# EasyEDA Pro project motherboard.epro

# Schematic Schematic1
Board Name: Board1; Create Date: 2025-01-26; Page Name: P1; Project Name: boxie-board; Schematic Name: Schematic1; Update Date: 2025-01-29; Company: EasyEDA.com; Drawn: EasyEDA; Page Size: A4; Part Number: JLCPCB-002; Reviewed: EasyEDA; Version: V0.1
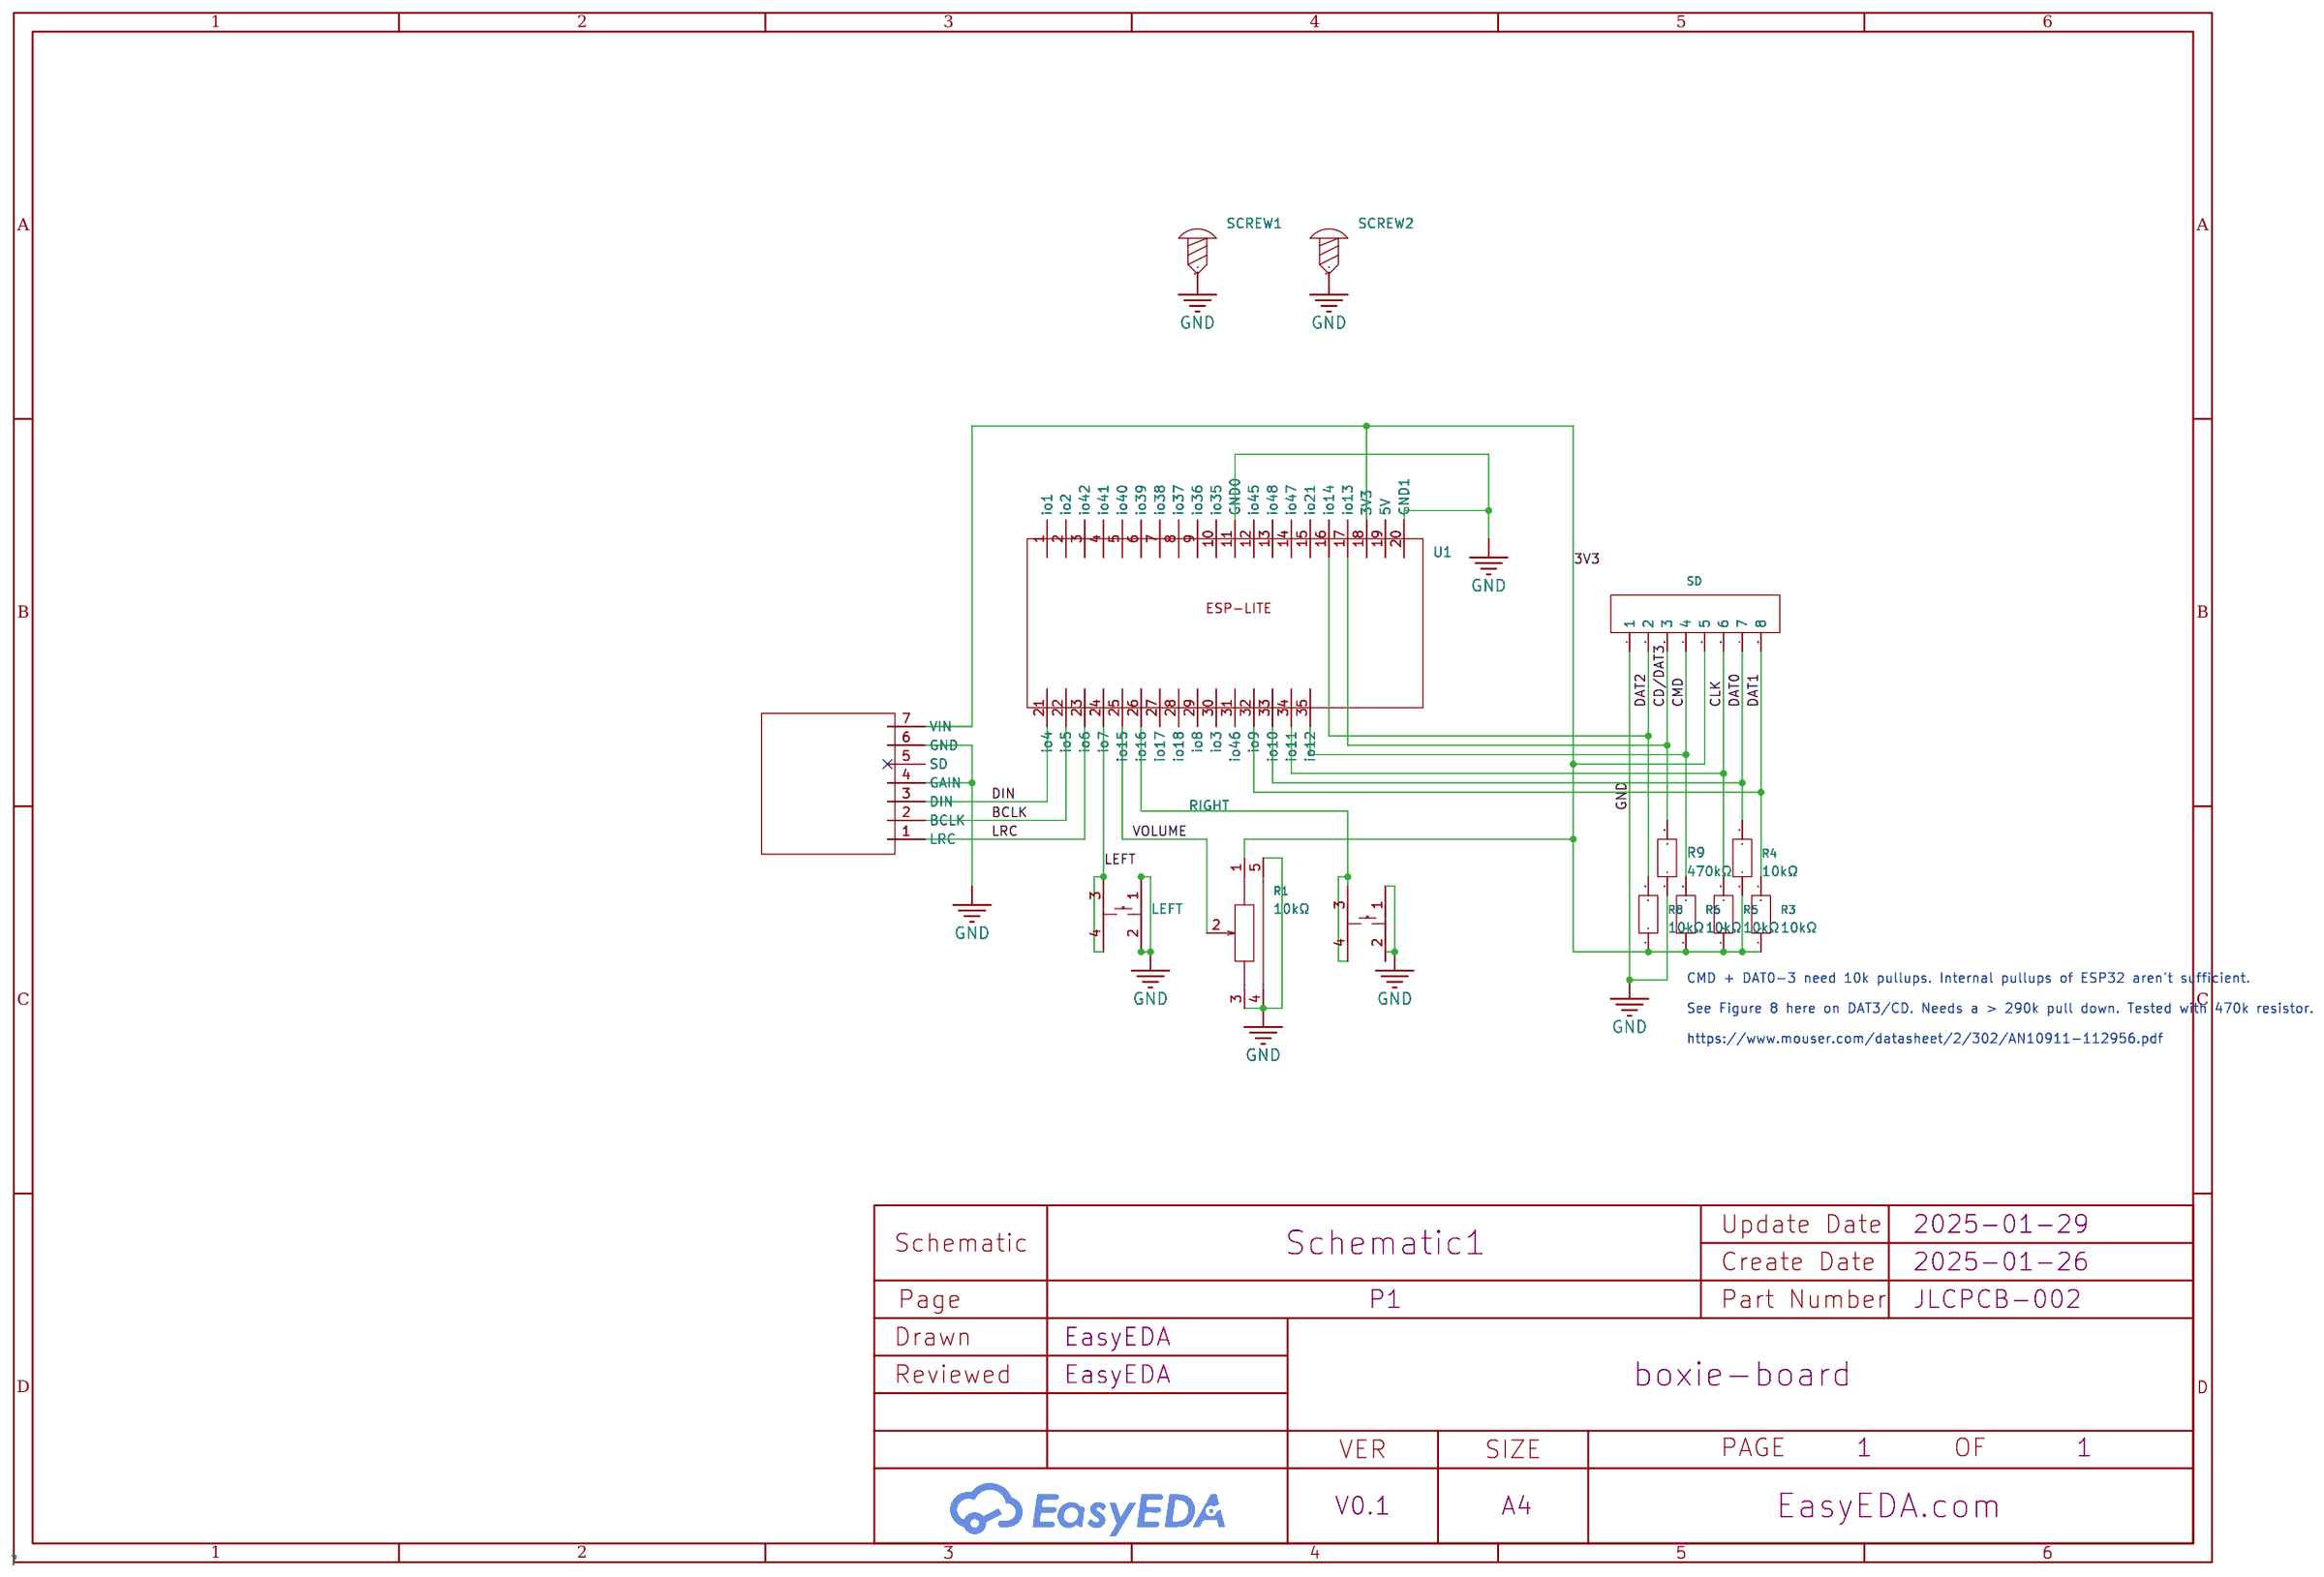
[diagram p0: schematic sheet]

## Parts
LEFT  GT-TC074E-H045-L1  [SW-SMD_4P-L4.5-W4.5-P3.00-LS7.5]
R1  10kΩ  [RES-TH_RK09K1130AAU]
R3  10kΩ  [R0805]
R4  10kΩ  [R0805]
R5  10kΩ  [R0805]
R6  10kΩ  [R0805]
R8  10kΩ  [R0805]
R9  470kΩ  [R0805]
RIGHT  GT-TC074E-H045-L1  [SW-SMD_4P-L4.5-W4.5-P3.00-LS7.5]
SCREW1  -  [Screw-Hole-M3]
SCREW2  -  [Screw-Hole-M3]
SD  -  [HDR-TH_8P-P2.54-V-F-1]
U1  -  [esp32-lite]
U4  MAX98357A-I2S  [MAX98357A_I2S_footprint]

## Library data of the parts
LEFT RIGHT = GT-TC074E-H045-L1: Circuit:SPST Actuator Style:Round Button Operating Force:130gf Mounting Style:Brick nogging Switch Length:4.5mm Switch Width:4.5mm Switch Height:4.5mm Strike Gundam:不带 Contact Current:50mA Voltage Rating (DC):12V Insulation Resistance:100MΩ Actuator/Cap C; LCSC Part Name: 4.5*4.5*4.5mm 立贴 轻触开关; Supplier Part: C963226; Manufacturer: G-Switch(品赞); Supplier Footprint: SMD; JLCPCB Part Class: Extended Part; Datasheet: https://atta.szlcsc.com/upload/public/pdf/source/20200902/C778171_CAA5F7D188867E23168B3FF42AF8C49B.pdf; Supplier: LCSC; Circuit: SPST; Actuator Style: Round Button; Operating Force: 130gf; Mounting Style: Brick nogging; Switch Length: 4.5mm; Switch Width: 4.5mm; Switch Height: 4.5mm; Strike Gundam: 不带; Contact Current: 50mA; Voltage Rating (DC): 12V; Insulation Resistance: 100MΩ; Actuator/Cap Color: Black; With Lamp: No; Pin Style: Gull Wing; Mechanical Life: 10万次; Operating Temperature: -30℃~+85℃
R1 = RK09K1130AAU: Resistance: Tolerance:±20% Tolerance:±20%; LCSC Part Name: 10kΩ ±20%; Supplier Part: C202373; Manufacturer: ALPSALPINE(阿尔卑斯阿尔派); Supplier Footprint: 插件; JLCPCB Part Class: Extended Part; Datasheet: https://atta.szlcsc.com/upload/public/pdf/source/20180403/C202373_6A10D7C408ADBD3CAC5DCE7BA8BA3007.pdf; Supplier: LCSC; Tolerance: ±20%
R3-R6 R8 = ERA6VEB1002V: Type:Thin Film Resistor Resistance:10kΩ Tolerance:±0.1% Tolerance:±0.1% Power(Watts): Overload Voltage (Max): Temperature Coefficient:±25ppm/℃ Temperature Coefficient:±25ppm/℃ Operating Temperature Range:-55℃~+155℃ Operating Temperature Range:-55℃~+155℃; LCSC Part Name: 10kΩ ±0.1% 250mW 薄膜电阻; Supplier Part: C490804; Manufacturer: PANASONIC(松下); Supplier Footprint: 0805; JLCPCB Part Class: Extended Part; Datasheet: https://atta.szlcsc.com/upload/public/pdf/source/20200407/C490804_E79445038A464C1C5FF8B3F1C2F9F4D4.pdf; Supplier: LCSC; Type: Thin Film Resistor; Tolerance: ±0.1%; Temperature Coefficient: ±25ppm/℃; Operating Temperature Range: -55℃~+155℃
R9 = ERJ6GEYJ474V: Type:Thick Film Resistors Resistance:470kΩ Tolerance:±5% Tolerance:±5% Power(Watts): Overload Voltage (Max):- Temperature Coefficient:±200ppm/℃ Temperature Coefficient:±200ppm/℃ Operating Temperature Range:-55℃~+155℃ Operating Temperature Range:-55℃~+155℃; LCSC Part Name: 470kΩ ±5% 125mW 厚膜电阻; Supplier Part: C413225; Manufacturer: PANASONIC(松下); Supplier Footprint: 0805; JLCPCB Part Class: Extended Part; Datasheet: https://atta.szlcsc.com/upload/public/pdf/source/20190820/C413225_BF0E9D17BD6FA7B1F7DA2197481910D1.pdf; Supplier: LCSC; Type: Thick Film Resistors; Tolerance: ±5%; Temperature Coefficient: ±200ppm/℃; Operating Temperature Range: -55℃~+155℃
SCREW1 SCREW2 = Screw-Hole-M3: Supplier Footprint: 插件
SD = HDR-F_2.54_1x8P: Supplier: LCSC; Manufacturer: BOOMELE(博穆精密); Manufacturer Part: 2.54-1*8P母环保; Supplier Part: C27438; JLCPCB Part Class: Extended Part; Supplier Footprint: Through
U1 = esp32-lite
U4 = MAX98357 Breakboard

## Nets
3V3: R1.1 R3.1 R4.2 R5.1 R6.1 R8.1 SD.5 U1.18(3V3) U4.7(VIN)
GND: LEFT.1 LEFT.2 R1.3 R1.4(EH) R1.5(EH) R9.1 RIGHT.1 RIGHT.2 SCREW1.1 SCREW2.1 SD.1 U1.11(GND0) U1.20(GND1) U4.4(GAIN) U4.6(GND)
BCLK: U1.22(io5) U4.2(BCLK)
CD/DAT3: R9.2 SD.3 U1.17(io13)
CLK: R5.2 SD.6 U1.34(io11)
CMD: R6.2 SD.4 U1.35(io12)
DAT0: R4.1 SD.7 U1.33(io10)
DAT1: R3.2 SD.8 U1.32(io9)
DAT2: R8.2 SD.2 U1.16(io14)
DIN: U1.21(io4) U4.3(DIN)
LEFT: LEFT.3 LEFT.4 U1.24(io7)
LRC: U1.23(io6) U4.1(LRC)
VOLUME: R1.2 U1.25(io15)
$1N966: RIGHT.3 RIGHT.4 U1.26(io16)

Not connected (* = marked no-connect by the designer): U1 1(io1) 2(io2) 3(io42) 4(io41) 5(io40) 6(io39) 7(io38) 8(io37) 9(io36) 10(io35) 12(io45) 13(io48) 14(io47) 15(io21) 19(5V) 27(io17) 28(io18) 29(io8) 30(io3) 31(io46); U4 5(SD)*

## Notes on the sheet
- CMD + DAT0-3 need 10k pullups. Internal pullups of ESP32 aren't sufficient.
  See Figure 8 here on DAT3/CD. Needs a > 290k pull down. Tested with 470k resistor.
  https://www.mouser.com/datasheet/2/302/AN10911-112956.pdf

# Board PCB1
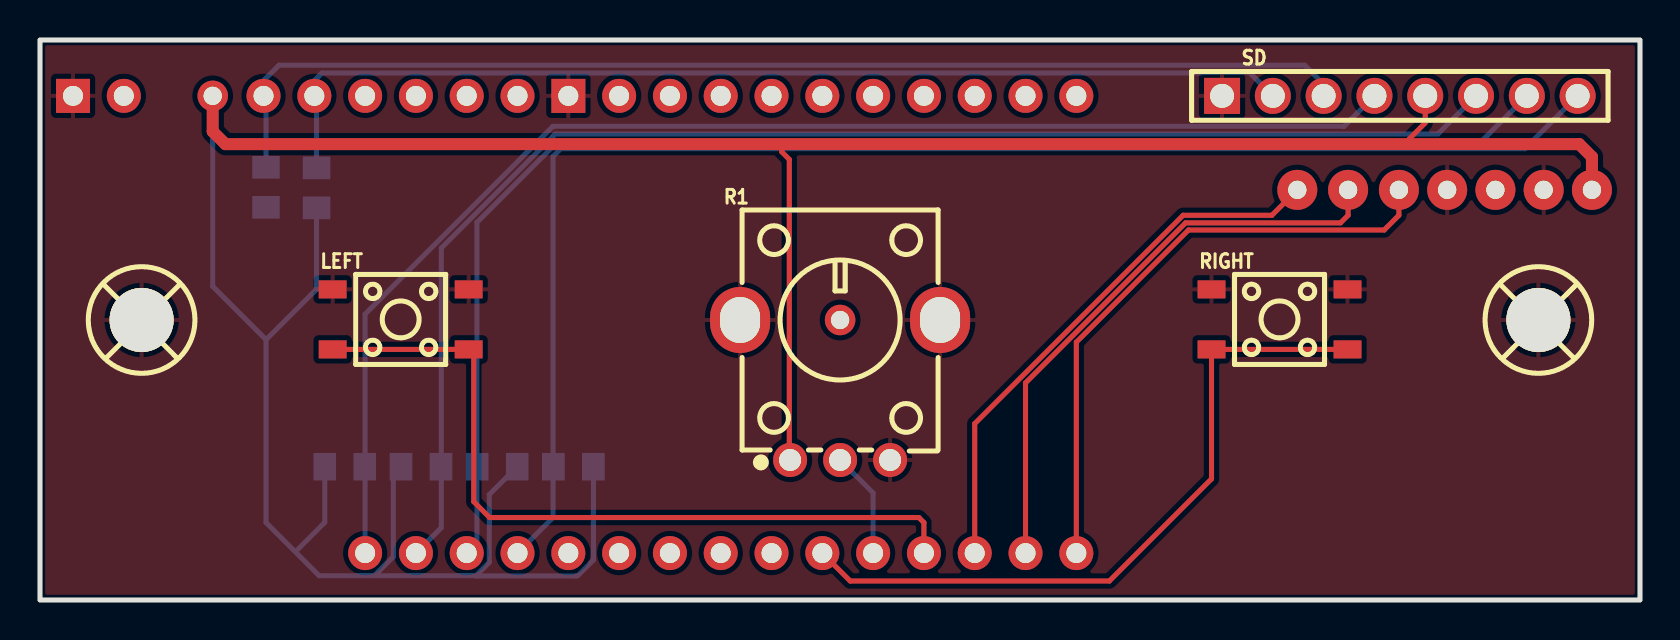
[diagram p1: board, top side]
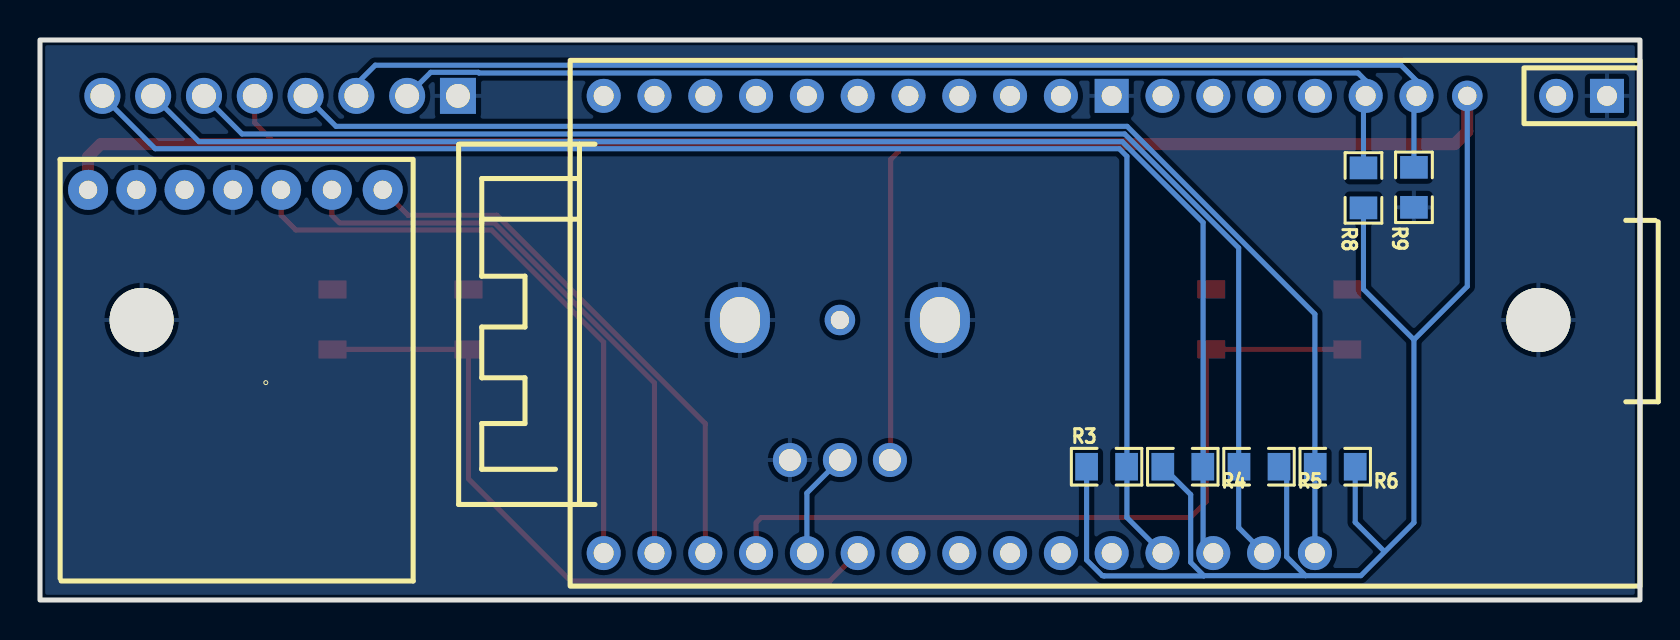
[diagram p2: board, bottom side, seen from below]

Outline 80 x 28 mm; copper layers: Top Layer, Bottom Layer. Coordinates in mm from the lower left corner of the outline.
Outline path: rectangle 0,28 80,0
Stack: Top Layer 0.035mm / Dielectric1 1.51mm FR4 er 4.5 / Bottom Layer 0.035mm

## Design rules (mm)
template: JLCPCB Capability(Two Layers Board)
spacing copperThickness1oz (default): track to track 0.102, other pairs 0.152 to 0.3
spacing copperThickness2oz: track to track 0.203, other pairs 0.152 to 0.3
track width copperThickness1oz (default): min 0.127, default 0.254, max 2.54
track width copperThickness2oz: min 0.203, default 0.254, max 2.54
differential pair differentialPair (default): width min 0.127, default 0.254, max 2.54; gap min 0.152, default 0.152
via viaSize (default): diameter min 0.5, default 0.61, max 10; hole min 0.3, default 0.305, max 6.3

## Placement (name value [footprint] x y rotation side)
LEFT  GT-TC074E-H045-L1  [SW-SMD_4P-L4.5-W4.5-P3.00-LS7.5]  18.03 14.03 0 top
NOREF  -  [Pad_e17]  40 14 0 top
R1  10kΩ  [RES-TH_RK09K1130AAU]  40 10.5 0 top
R3  10kΩ  [R0805]  26.67 6.66 180 bottom
R4  10kΩ  [R0805]  22.86 6.66 0 bottom
R5  10kΩ  [R0805]  19.05 6.66 0 bottom
R6  10kΩ  [R0805]  15.24 6.66 0 bottom
R8  10kΩ  [R0805]  13.83 20.6 90 bottom
R9  470kΩ  [R0805]  11.3 20.63 90 bottom
RIGHT  GT-TC074E-H045-L1  [SW-SMD_4P-L4.5-W4.5-P3.00-LS7.5]  61.98 14.03 0 top
SCREW1  -  [Screw-Hole-M3]  5.14 13.94 0 top
SCREW2  -  [Screw-Hole-M3]  74.98 13.94 0 top
SD  -  [HDR-TH_8P-P2.54-V-F-1]  67.99 25.21 0 top
U1  -  [esp32-lite]  0.25 0.31 0 bottom
U4  MAX98357A-I2S  [MAX98357A_I2S_footprint]  70.74 12.63 0 bottom

## Footprints (pads in the part's own frame, mm; a bottom-side part is the same pattern mirrored in y, then rotated)
esp32-lite
  round 1.7 hole 1: 1(51.562,-24.892) 2(49.022,-24.892) 3(46.482,-24.892) 4(43.942,-24.892) 5(41.402,-24.892) 6(38.862,-24.892) 7(36.322,-24.892) 8(33.782,-24.892) 9(31.242,-24.892) 10(28.702,-24.892) 12(23.622,-24.892) 13(21.082,-24.892) 14(18.542,-24.892) 15(16.002,-24.892) 16(13.462,-24.892) 17(10.922,-24.892) 19(3.937,-24.892) 21(51.562,-2.032) 22(49.022,-2.032) 23(46.482,-2.032) 24(43.942,-2.032) 25(41.402,-2.032) 26(38.862,-2.032) 27(36.322,-2.032) 28(33.782,-2.032) 29(31.242,-2.032) 30(28.702,-2.032) 31(26.162,-2.032) 32(23.622,-2.032) 33(21.082,-2.032) 34(18.542,-2.032) 35(16.002,-2.032)
  rect 1.7x1.7 hole 1: 11(26.162,-24.892) 20(1.397,-24.892)
  round 1.524 hole 0.914: 18(8.382,-24.892)
HDR-TH_8P-P2.54-V-F-1
  rect 1.8x1.8 hole 1.2: 1(-8.89,0)
  round 1.8 hole 1.2: 2(-6.35,0) 3(-3.81,0) 4(-1.27,0) 5(1.27,0) 6(3.81,0) 7(6.35,0) 8(8.89,0)
MAX98357A_I2S_footprint
  round 2 hole 0.914: 1(-7.874,-7.874) 2(-5.334,-7.874) 3(-2.794,-7.874) 4(-0.381,-7.874) 5(2.032,-7.874) 6(4.445,-7.874) 7(6.858,-7.874)
Pad_e17
  round 1.524 hole 0.914: 1(0,0)
R0805
  rect 1.133x1.377 smd: 1(-1,0) 2(1,0)
RES-TH_RK09K1130AAU
  round 1.7 hole 1.1: 1(-2.5,-3.5) 2(0,-3.5) 3(2.5,-3.5)
  oval 3x3.3 hole 2x2.3: 4(5,3.5) 5(-5,3.5)
Screw-Hole-M3
  round 3.2 hole 3.2: 1(-0.064,0.064)
SW-SMD_4P-L4.5-W4.5-P3.00-LS7.5
  rect 1.4x0.9 smd: 1(-3.4,1.5) 2(3.4,1.5) 3(-3.4,-1.5) 4(3.4,-1.5)

## Nets
As in the schematic.

Pads without a net: NOREF 1; U1 1 2 3 4 5 6 7 8 9 10 12 13 14 15 19 27 28 29 30 31; U4 5

## Routing (per net, layer and track width the routed paths; a pad name or vN(x,y) marks a point on that pad's centre or on a via; arc(x,y) is an arc through that point)
3V3: length 160.7
  Top Layer w0.254: 37.08,22.54 37.08,22.41 37.47,22.03 37.47,7.04 R1.1 ; 68.45,23.05 69.26,23.86 SD.5
  Top Layer w0.6: 77.6,20.51 77.6,22.16 76.96,22.79 9.27,22.79 8.64,23.43 U1.18
  Bottom Layer w0.254: 21.8,1.22 16.72,1.22 ; 21.8,1.22 22.47,1.88 22.47,5.27 R4.2 ; 21.8,1.22 21.82,1.2 26.8,1.2 26.81,1.22 26.88,1.22 27.67,2 R3.1 ; 16.72,1.22 17.67,2.16 17.67,6.28 R5.1 ; 16.72,1.22 13.96,1.22 11.3,3.87 11.3,13.01 ; R6.1 14.24,3.89 12.83,2.47 ; 11.3,13.01 13.83,15.54 R8.1 ; 11.3,13.01 8.64,15.68 U1.18
BCLK: length 29.4
  Top Layer w0.254: 65.41,20.51 65.41,19.24 65.02,18.86 57.28,18.86 49.28,10.86 U1.22
CD/DAT3: length 58.7
  Bottom Layer w0.254: SD.3 64.18,25.79 63.24,26.74 11.95,26.74 11.18,25.97 U1.17 11.3,25.08 R9.2
CLK: length 70.7
  Bottom Layer w0.254: SD.6 69.9,23.3 25.76,23.3 20.07,17.6 20.07,3.62 U1.34
CMD: length 66.9
  Bottom Layer w0.254: U1.35 16.26,14.3 25.64,23.68 65.2,23.68 SD.4
DAT0: length 71.9
  Bottom Layer w0.254: SD.7 72.06,22.92 25.89,22.92 21.84,18.88 21.84,2.85 U1.33
DAT1: length 73.1
  Bottom Layer w0.254: U1.32 25.65,4.12 25.65,22.18 26.03,22.56 74.24,22.56 SD.8
DAT2: length 53
  Bottom Layer w0.254: R8.2 13.83,25.1 U1.16 13.72,25.97 14.1,26.35 58.05,26.35 58.09,26.39 60.46,26.39 SD.2
DIN: length 30.6
  Top Layer w0.254: U1.21 51.82,12.89 57.42,18.5 67.21,18.5 67.94,19.24 67.94,20.51
LEFT: length 39
  Top Layer w0.254: U1.24 44.2,3.87 43.94,4.12 22.48,4.12 21.69,4.92 21.69,12.28 LEFT.4 LEFT.3
LRC: length 27.4
  Top Layer w0.254: U1.23 46.74,8.82 57.15,19.24 61.59,19.24 62.87,20.51
VOLUME: length 5.3
  Bottom Layer w0.254: R1.2 41.66,5.35 U1.25
$1N966: length 35.4
  Top Layer w0.254: RIGHT.4 RIGHT.3 58.58,6.06 53.47,0.95 40.51,0.95 U1.26

## Copper pours and planes (outline as drawn; the poured copper is in the pictures)
GND on Top Layer: 0,28 80,28 80,0 0,0
GND on Bottom Layer: 0,28 80,28 80,0 0,0
